# Altium schematic sheet emu.SchDoc
size A4
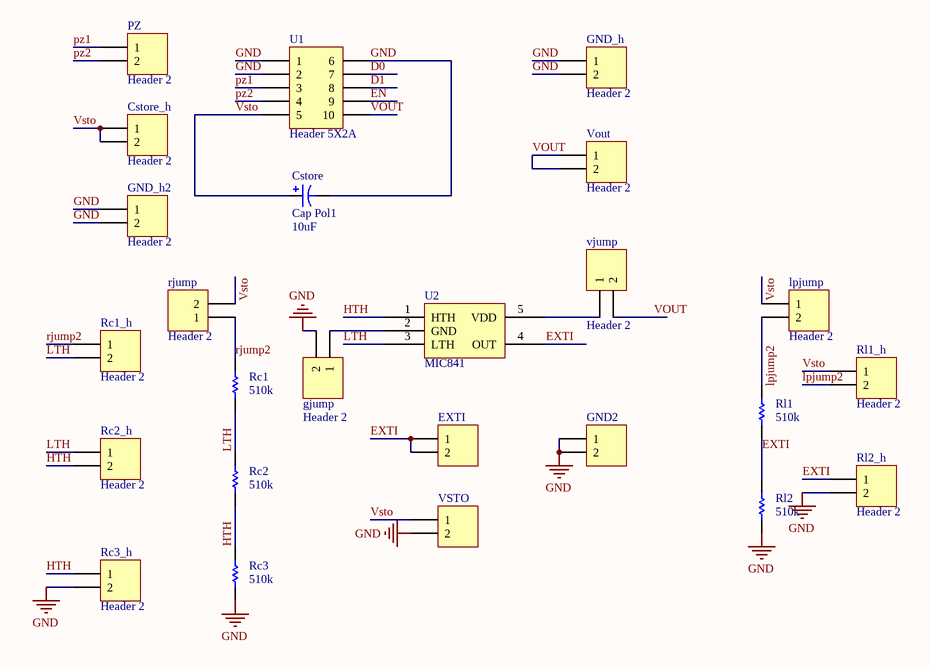
[diagram p0: emu.SchDoc]

## Parts
Cstore  Cap Pol1  value 10uF  [直插电容]
Cstore_h  Header 2  [HDR1X2]
EXTI  Header 2  [HDR1X2]  (value not drawn)
gjump  Header 2  [HDR1X2]
GND2  Header 2  [HDR1X2]  (value not drawn)
GND_h  Header 2  [HDR1X2]
GND_h2  Header 2  [HDR1X2]
lpjump  Header 2  [HDR1X2]
PZ  Header 2  [HDR1X2]
Rc1  value 510k  [6-0805_N]  (hidden comment: Res1)
Rc1_h  Header 2  [HDR1X2]
Rc2  value 510k  [6-0805_N]  (hidden comment: Res1)
Rc2_h  Header 2  [HDR1X2]
Rc3  value 510k  [6-0805_N]  (hidden comment: Res1)
Rc3_h  Header 2  [HDR1X2]
rjump  Header 2  [HDR1X2]
Rl1  value 510k  [6-0805_N]  (hidden comment: Res1)
Rl1_h  Header 2  [HDR1X2]
Rl2  value 510k  [6-0805_N]  (hidden comment: Res1)
Rl2_h  Header 2  [HDR1X2]
U1  Header 5X2A  [ltc3588]
U2  MIC841  [mic841]
vjump  Header 2  [HDR1X2]
Vout  Header 2  [HDR1X2]
VSTO  Header 2  [HDR1X2]  (value not drawn)

## Nets
GND: Cstore.2 gjump.2 GND2.1 GND2.2 GND_h.1 GND_h.2 GND_h2.1 GND_h2.2 Rc3.1 Rc3_h.2 Rl2.1 Rl2_h.2 U1.1 U1.2 U1.6 VSTO.2
D0: U1.7
D1: U1.8
EN: U1.9
EXTI: EXTI.1 EXTI.2 Rl1.1 Rl2.2 Rl2_h.1 U2.4(OUT)
HTH: Rc2.1 Rc2_h.2 Rc3.2 Rc3_h.1 U2.1(HTH)
lpjump2: lpjump.2 Rl1.2 Rl1_h.2
LTH: Rc1.1 Rc1_h.2 Rc2.2 Rc2_h.1 U2.3(LTH)
pz1: PZ.1 U1.3
pz2: PZ.2 U1.4
rjump2: Rc1.2 Rc1_h.1 rjump.1
VOUT: U1.10 vjump.2 Vout.1 Vout.2
Vsto: Cstore.1 Cstore_h.1 Cstore_h.2 lpjump.1 rjump.2 Rl1_h.1 U1.5 VSTO.1
Netgjump_1: gjump.1 U2.2(GND)
NetU2_5: U2.5(VDD) vjump.1

## Library data of the parts
Cstore = Cap Pol1: Polarized Capacitor (Radial); Published: 8-Jun-2000; LatestRevisionDate: 17-Jul-2002; LatestRevisionNote: Re-released for DXP Platform.; PackageReference: RB7.6-15; Publisher: Altium Limited; PackageDescription: Polarized Capacitor (Radial); 2 Leads
Cstore_h EXTI gjump GND2 GND_h GND_h2 lpjump PZ Rc1_h Rc2_h Rc3_h rjump Rl1_h Rl2_h vjump Vout VSTO = Header 2: Header, 2-Pin; LatestRevisionDate: 17-Jul-2002; LatestRevisionNote: Re-released for DXP Platform.; Publisher: Altium Limited
Rc1-Rc3 Rl1 Rl2 = Res1: Resistor; Published: 8-Jun-2000; LatestRevisionDate: 17-Jul-2002; LatestRevisionNote: Re-released for DXP Platform.; PackageReference: AXIAL-0.3; Publisher: Altium Limited; PackageDescription: Axial Device, Thru-Hole; 2 Leads; 0.3 in Pin Spacing
U1 = Header 5X2A: Header, 5-Pin, Dual row; LatestRevisionDate: 17-Jul-2002; LatestRevisionNote: Re-released for DXP Platform.; Publisher: Altium Limited
U2 = Component_1